# Altium project FMC_ADC_250M_16B_4ch_LNLS.PrjPCB (part 1 of 4)
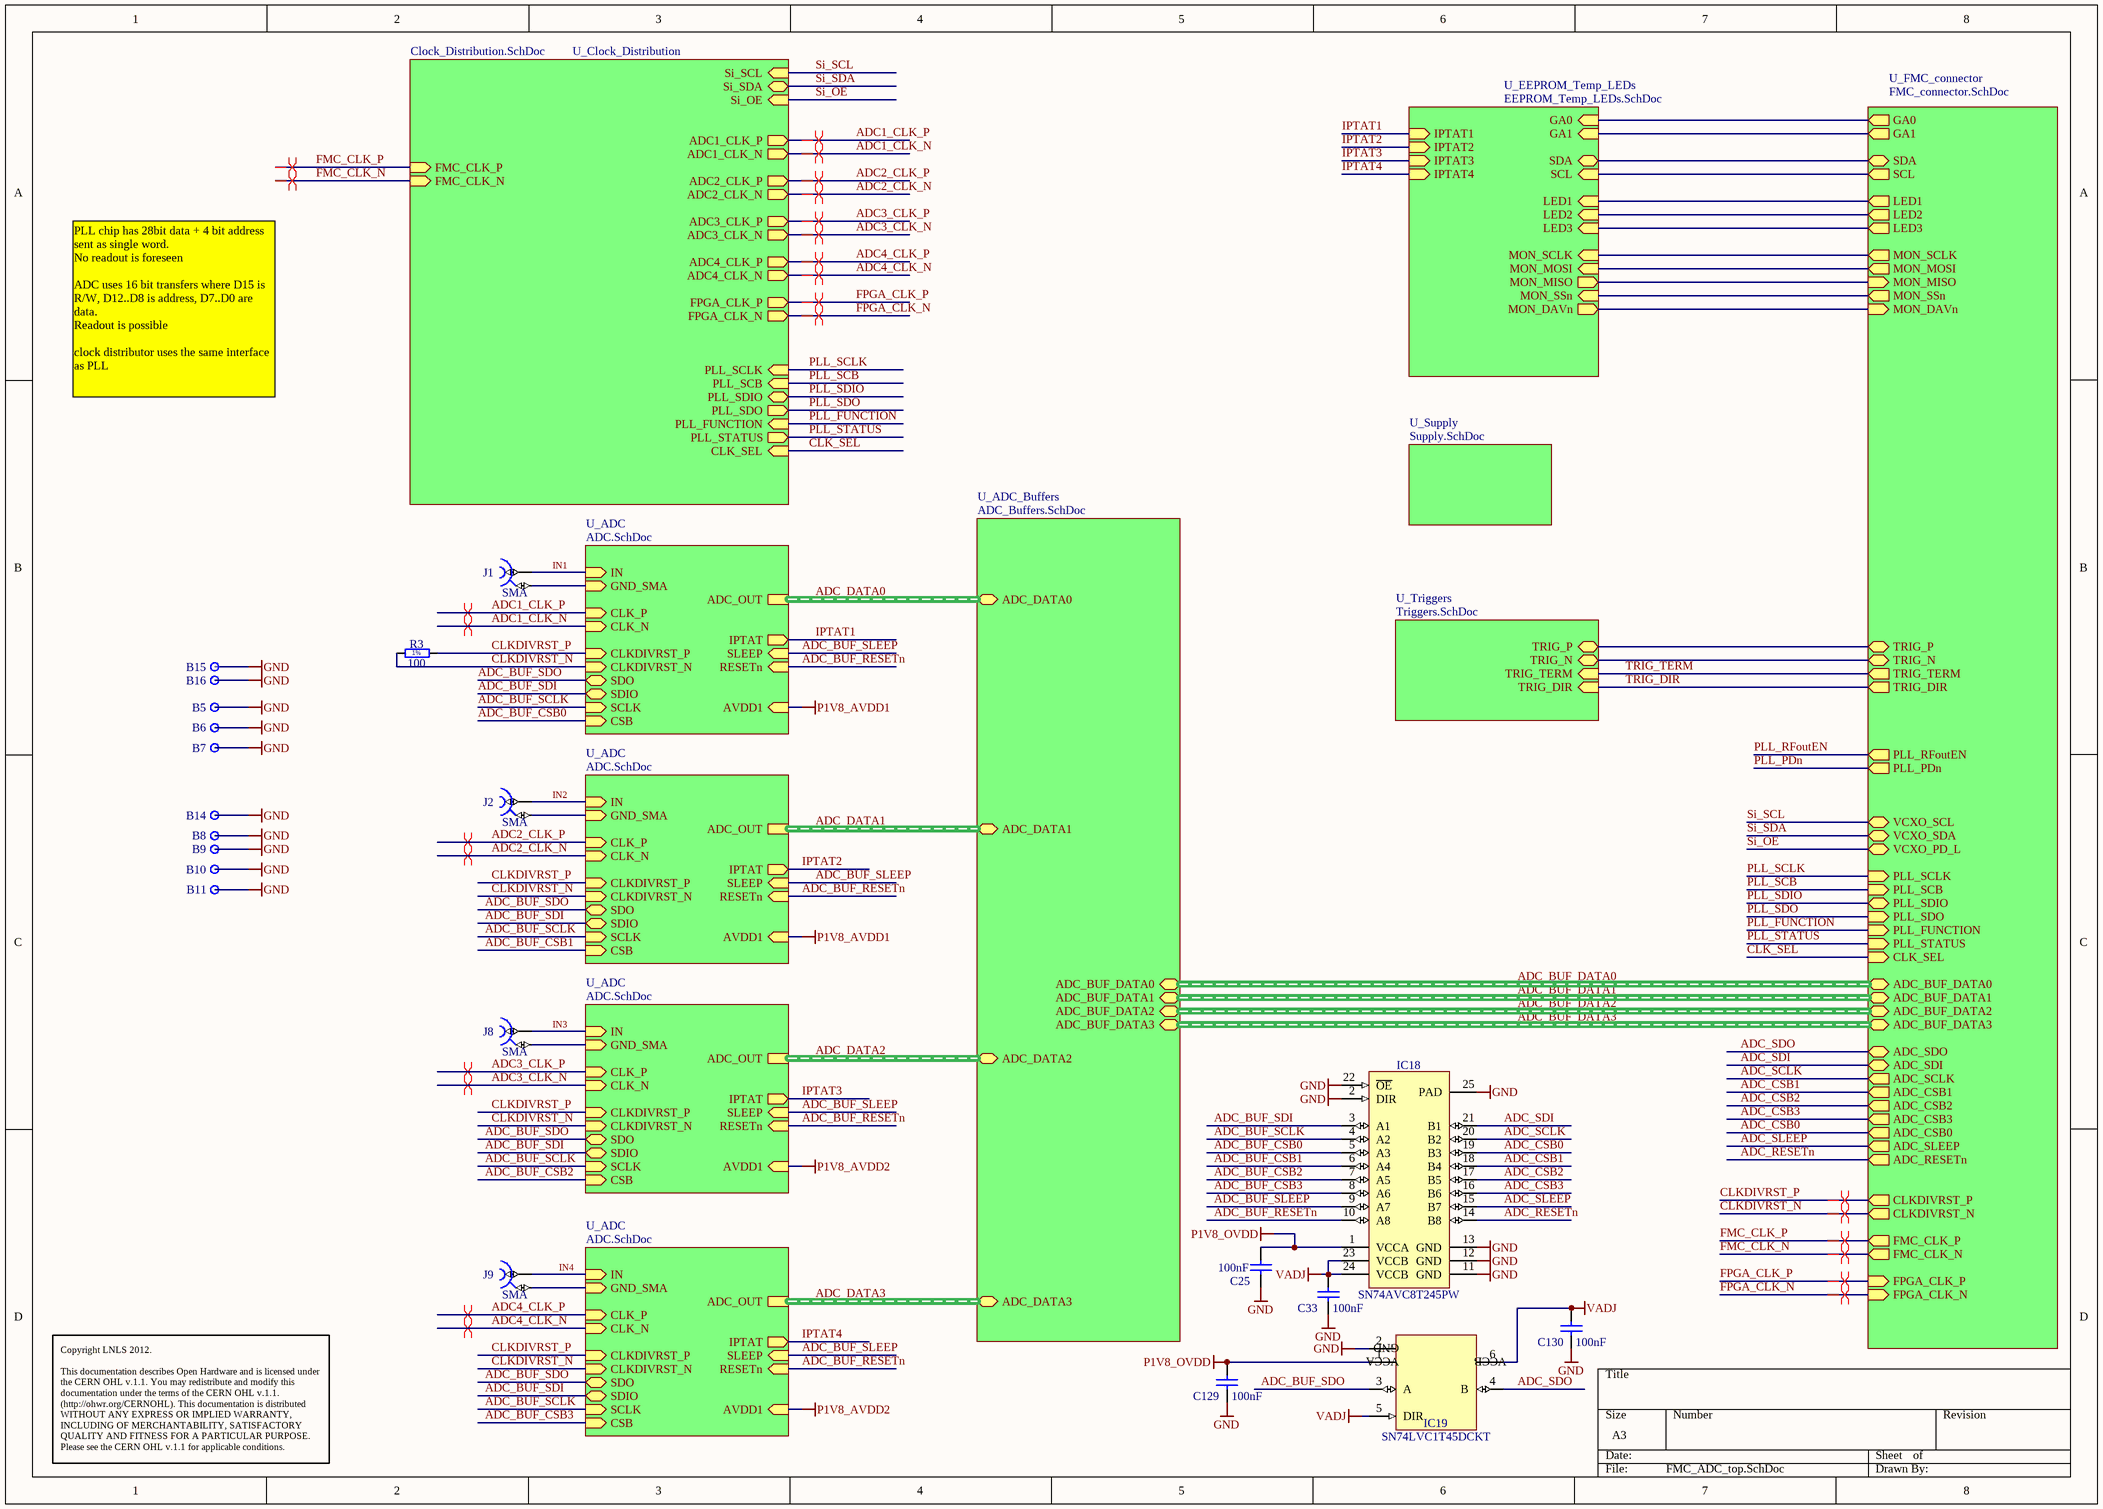
[diagram p0: FMC_ADC_top.SchDoc]
8 sheets, 374 parts. Net scope: hierarchical (ports join the sheet entries above them; power ports are global).
Board files: shield.PcbDoc, FMC_ADC_250M_16B_4ch_pcb.PcbDoc, panel_silk.PcbDoc
Sheets:
  FMC_ADC_top.SchDoc
    U_EEPROM_Temp_LEDs = EEPROM_Temp_LEDs.SchDoc
    U_FMC_connector = FMC_connector.SchDoc
    U_ADC = ADC.SchDoc
    U_Supply = Supply.SchDoc
    U_Clock_Distribution = Clock_Distribution.SchDoc
    U_ADC = ADC.SchDoc
    U_ADC = ADC.SchDoc
    U_ADC = ADC.SchDoc
    U_ADC_Buffers = ADC_Buffers.SchDoc
    U_Triggers = Triggers.SchDoc

## Sheet FMC_ADC_top.SchDoc
size A3

### Parts
B5  Plated Hole  [MTG240_400_M]  (value not drawn)
B6  Plated Hole  [MTG240_400_M]  (value not drawn)
B7  Plated Hole  [MTG240_400_M]  (value not drawn)
B8  Plated Hole  [MTG240_400_M]  (value not drawn)
B9  Plated Hole  [MTG240_400_M]  (value not drawn)
B10  Plated Hole  [MTG240_400_M]  (value not drawn)
B11  Plated Hole  [MTG240_400_M]  (value not drawn)
B14  Plated Hole  [MTG240_400_M]  (value not drawn)
B15  Plated Hole  [MTG240_400_M]  (value not drawn)
B16  Plated Hole  [MTG240_400_M]  (value not drawn)
C25  100nF  [CAPC0603X33N]
C33  100nF  [CAPC0603X33N]
C129  100nF  [CAPC0603X33N]
C130  100nF  [CAPC0603X33N]
IC18  SN74AVC8T245PW  [SOP65P640X120-24N]
IC19  SN74LVC1T45DCKT  [SOT65P210X110-6N]
J1  SMA  [AMPHENOL_901-143_IN BOARD]
J2  SMA  [AMPHENOL_901-143_IN BOARD]
J8  SMA  [AMPHENOL_901-143_IN BOARD]
J9  SMA  [AMPHENOL_901-143_IN BOARD]
R3  100  [RESC1005X40N]

### Sub-sheets
U_ADC = ADC.SchDoc: ADC_OUT (harness ADC_OUT_Harness), SLEEP (in), CLK_P (in), CLK_N (in), IPTAT (out), RESETn (in), CLKDIVRST_P (in), CLKDIVRST_N (in), SDO (bidir), SDIO (bidir), SCLK (in), CSB (in), IN (in), AVDD1 (in), GND_SMA (in)
U_ADC = ADC.SchDoc: ADC_OUT (harness ADC_OUT_Harness), SLEEP (in), CLK_P (in), CLK_N (in), IPTAT (out), RESETn (in), CLKDIVRST_P (in), CLKDIVRST_N (in), SDO (bidir), SDIO (bidir), SCLK (in), CSB (in), IN (in), AVDD1 (in), GND_SMA (in)
U_ADC = ADC.SchDoc: ADC_OUT (harness ADC_OUT_Harness), SLEEP (in), CLK_P (in), CLK_N (in), IPTAT (out), RESETn (in), CLKDIVRST_P (in), CLKDIVRST_N (in), SDO (bidir), SDIO (bidir), SCLK (in), CSB (in), IN (in), AVDD1 (in), GND_SMA (in)
U_ADC = ADC.SchDoc: ADC_OUT (harness ADC_OUT_Harness), SLEEP (in), CLK_P (in), CLK_N (in), IPTAT (out), RESETn (in), CLKDIVRST_P (in), CLKDIVRST_N (in), SDO (bidir), SDIO (bidir), SCLK (in), CSB (in), IN (in), AVDD1 (in), GND_SMA (in)
U_ADC_Buffers = ADC_Buffers.SchDoc: ADC_DATA1 (harness ADC_OUT_Harness), ADC_DATA2 (harness ADC_OUT_Harness), ADC_DATA3 (harness ADC_OUT_Harness), ADC_BUF_DATA1 (harness ADC_OUT_Harness), ADC_BUF_DATA2 (harness ADC_OUT_Harness), ADC_BUF_DATA3 (harness ADC_OUT_Harness), ADC_BUF_DATA0 (harness ADC_OUT_Harness), ADC_DATA0 (harness ADC_OUT_Harness)
U_Clock_Distribution = Clock_Distribution.SchDoc: ADC1_CLK_P (out), ADC1_CLK_N (out), ADC2_CLK_P (out), ADC2_CLK_N (out), ADC3_CLK_P (out), ADC3_CLK_N (out), ADC4_CLK_P (out), ADC4_CLK_N (out), FPGA_CLK_P (out), FPGA_CLK_N (out), FMC_CLK_P (in), FMC_CLK_N (in), Si_SDA (bidir), Si_SCL (in), Si_OE (in), PLL_SCLK (in), PLL_SCB (in), PLL_SDIO (bidir), PLL_SDO (out), PLL_FUNCTION (in), PLL_STATUS (out), CLK_SEL (in)
U_EEPROM_Temp_LEDs = EEPROM_Temp_LEDs.SchDoc: LED1 (in), LED3 (in), SDA (bidir), SCL (in), GA0 (in), GA1 (in), IPTAT1 (in), IPTAT2 (in), IPTAT3 (in), IPTAT4 (in), MON_SCLK (in), MON_MOSI (in), MON_MISO (out), MON_SSn (in), MON_DAVn (out), LED2 (in)
U_FMC_connector = FMC_connector.SchDoc: ADC_BUF_DATA1 (harness ADC_OUT_Harness), ADC_BUF_DATA2 (harness ADC_OUT_Harness), ADC_BUF_DATA3 (harness ADC_OUT_Harness), ADC_BUF_DATA0 (harness ADC_OUT_Harness), ADC_SDO (bidir), ADC_SDI (bidir), ADC_SCLK (out), ADC_CSB1 (out), ADC_CSB2 (out), ADC_CSB3 (out), ADC_CSB0 (out), ADC_RESETn (out), CLKDIVRST_P (out), CLKDIVRST_N (out), FMC_CLK_P (out), FMC_CLK_N (out), FPGA_CLK_P (in), FPGA_CLK_N (in), GA0 (out), GA1 (out), SDA (bidir), SCL (out), VCXO_SCL (bidir), VCXO_SDA (bidir), VCXO_PD_L (bidir), PLL_RFoutEN (out), PLL_PDn (out), TRIG_DIR (out), TRIG_TERM (out), PLL_SCLK (in), PLL_SCB (in), PLL_SDIO (bidir), PLL_SDO (in), PLL_FUNCTION (in), PLL_STATUS (in), CLK_SEL (in), TRIG_P (bidir), TRIG_N (bidir), MON_SCLK (out), MON_MOSI (out), MON_MISO (in), MON_SSn (out), MON_DAVn (in), ADC_SLEEP (out), LED1 (out), LED2 (out), LED3 (out)
U_Supply = Supply.SchDoc: no entries
U_Triggers = Triggers.SchDoc: TRIG_DIR (in), TRIG_N (bidir), TRIG_P (bidir), TRIG_TERM (in)

### Nets
GND: B5.1 B6.1 B7.1 B8.1 B9.1 B10.1 B11.1 B14.1 B15.1 B16.1 C25.2 C33.1 C129.1 C130.1 IC18.2(DIR) IC18.11(GND) IC18.12(GND) IC18.13(GND) IC18.22(~{OE}) IC18.25(PAD) IC19.2(GND)
P1V8_AVDD1: sheet U_ADC/AVDD1, sheet U_ADC/AVDD1
P1V8_AVDD2: sheet U_ADC/AVDD1, sheet U_ADC/AVDD1
P1V8_OVDD: C25.1 C129.2 IC18.1(VCCA) IC19.1(VCCA)
VADJ: C33.2 C130.2 IC18.23(VCCB) IC18.24(VCCB) IC19.5(DIR) IC19.6(VCCB)
ADC1_CLK_N: sheet U_ADC/CLK_N, sheet U_Clock_Distribution/ADC1_CLK_N
ADC1_CLK_P: sheet U_ADC/CLK_P, sheet U_Clock_Distribution/ADC1_CLK_P
ADC2_CLK_N: sheet U_Clock_Distribution/ADC2_CLK_N, sheet U_ADC/CLK_N
ADC2_CLK_P: sheet U_Clock_Distribution/ADC2_CLK_P, sheet U_ADC/CLK_P
ADC3_CLK_N: sheet U_Clock_Distribution/ADC3_CLK_N, sheet U_ADC/CLK_N
ADC3_CLK_P: sheet U_Clock_Distribution/ADC3_CLK_P, sheet U_ADC/CLK_P
ADC4_CLK_N: sheet U_Clock_Distribution/ADC4_CLK_N, sheet U_ADC/CLK_N
ADC4_CLK_P: sheet U_Clock_Distribution/ADC4_CLK_P, sheet U_ADC/CLK_P
ADC_BUF_CSB0: IC18.5(A3) ; sheet U_ADC/CSB
ADC_BUF_CSB1: IC18.6(A4) ; sheet U_ADC/CSB
ADC_BUF_CSB2: IC18.7(A5) ; sheet U_ADC/CSB
ADC_BUF_CSB3: IC18.8(A6) ; sheet U_ADC/CSB
ADC_BUF_RESETn: IC18.10(A8) ; sheet U_ADC/RESETn, sheet U_ADC/RESETn, sheet U_ADC/RESETn, sheet U_ADC/RESETn
ADC_BUF_SCLK: IC18.4(A2) ; sheet U_ADC/SCLK, sheet U_ADC/SCLK, sheet U_ADC/SCLK, sheet U_ADC/SCLK
ADC_BUF_SDI: IC18.3(A1) ; sheet U_ADC/SDIO, sheet U_ADC/SDIO, sheet U_ADC/SDIO, sheet U_ADC/SDIO
ADC_BUF_SDO: IC19.3(A) ; sheet U_ADC/SDO, sheet U_ADC/SDO, sheet U_ADC/SDO, sheet U_ADC/SDO
ADC_BUF_SLEEP: IC18.9(A7) ; sheet U_ADC/SLEEP, sheet U_ADC/SLEEP, sheet U_ADC/SLEEP, sheet U_ADC/SLEEP
ADC_CSB0: IC18.19(B3) ; sheet U_FMC_connector/ADC_CSB0
ADC_CSB1: IC18.18(B4) ; sheet U_FMC_connector/ADC_CSB1
ADC_CSB2: IC18.17(B5) ; sheet U_FMC_connector/ADC_CSB2
ADC_CSB3: IC18.16(B6) ; sheet U_FMC_connector/ADC_CSB3
ADC_RESETn: IC18.14(B8) ; sheet U_FMC_connector/ADC_RESETn
ADC_SCLK: IC18.20(B2) ; sheet U_FMC_connector/ADC_SCLK
ADC_SDI: IC18.21(B1) ; sheet U_FMC_connector/ADC_SDI
ADC_SDO: IC19.4(B) ; sheet U_FMC_connector/ADC_SDO
ADC_SLEEP: IC18.15(B7) ; sheet U_FMC_connector/ADC_SLEEP
CLK_SEL: sheet U_FMC_connector/CLK_SEL, sheet U_Clock_Distribution/CLK_SEL
CLKDIVRST_N: R3.1 ; sheet U_FMC_connector/CLKDIVRST_N, sheet U_ADC/CLKDIVRST_N, sheet U_ADC/CLKDIVRST_N, sheet U_ADC/CLKDIVRST_N, sheet U_ADC/CLKDIVRST_N
CLKDIVRST_P: R3.2 ; sheet U_FMC_connector/CLKDIVRST_P, sheet U_ADC/CLKDIVRST_P, sheet U_ADC/CLKDIVRST_P, sheet U_ADC/CLKDIVRST_P, sheet U_ADC/CLKDIVRST_P
FMC_CLK_N: sheet U_FMC_connector/FMC_CLK_N, sheet U_Clock_Distribution/FMC_CLK_N
FMC_CLK_P: sheet U_FMC_connector/FMC_CLK_P, sheet U_Clock_Distribution/FMC_CLK_P
FPGA_CLK_N: sheet U_FMC_connector/FPGA_CLK_N, sheet U_Clock_Distribution/FPGA_CLK_N
FPGA_CLK_P: sheet U_FMC_connector/FPGA_CLK_P, sheet U_Clock_Distribution/FPGA_CLK_P
GA0: sheet U_EEPROM_Temp_LEDs/GA0, sheet U_FMC_connector/GA0
GA1: sheet U_EEPROM_Temp_LEDs/GA1, sheet U_FMC_connector/GA1
IN1: J1.1 ; sheet U_ADC/IN
IN2: J2.1 ; sheet U_ADC/IN
IN3: J8.1 ; sheet U_ADC/IN
IN4: J9.1 ; sheet U_ADC/IN
IPTAT1: sheet U_EEPROM_Temp_LEDs/IPTAT1, sheet U_ADC/IPTAT
IPTAT2: sheet U_EEPROM_Temp_LEDs/IPTAT2, sheet U_ADC/IPTAT
IPTAT3: sheet U_EEPROM_Temp_LEDs/IPTAT3, sheet U_ADC/IPTAT
IPTAT4: sheet U_EEPROM_Temp_LEDs/IPTAT4, sheet U_ADC/IPTAT
LA24_N: sheet U_EEPROM_Temp_LEDs/LED2, sheet U_FMC_connector/LED2
LA24_P: sheet U_EEPROM_Temp_LEDs/LED3, sheet U_FMC_connector/LED3
LA28_N: sheet U_EEPROM_Temp_LEDs/MON_DAVn, sheet U_FMC_connector/MON_DAVn
LA29_P: sheet U_EEPROM_Temp_LEDs/LED1, sheet U_FMC_connector/LED1
LA30_N: sheet U_EEPROM_Temp_LEDs/MON_SSn, sheet U_FMC_connector/MON_SSn
LA30_P: sheet U_EEPROM_Temp_LEDs/MON_MISO, sheet U_FMC_connector/MON_MISO
LA31_N: sheet U_EEPROM_Temp_LEDs/MON_MOSI, sheet U_FMC_connector/MON_MOSI
LA31_P: sheet U_EEPROM_Temp_LEDs/MON_SCLK, sheet U_FMC_connector/MON_SCLK
LA33_N: sheet U_FMC_connector/TRIG_N, sheet U_Triggers/TRIG_N
LA33_P: sheet U_FMC_connector/TRIG_P, sheet U_Triggers/TRIG_P
PLL_FUNCTION: sheet U_FMC_connector/PLL_FUNCTION, sheet U_Clock_Distribution/PLL_FUNCTION
PLL_SCB: sheet U_FMC_connector/PLL_SCB, sheet U_Clock_Distribution/PLL_SCB
PLL_SCLK: sheet U_FMC_connector/PLL_SCLK, sheet U_Clock_Distribution/PLL_SCLK
PLL_SDIO: sheet U_FMC_connector/PLL_SDIO, sheet U_Clock_Distribution/PLL_SDIO
PLL_SDO: sheet U_FMC_connector/PLL_SDO, sheet U_Clock_Distribution/PLL_SDO
PLL_STATUS: sheet U_FMC_connector/PLL_STATUS, sheet U_Clock_Distribution/PLL_STATUS
SCL: sheet U_EEPROM_Temp_LEDs/SCL, sheet U_FMC_connector/SCL
SDA: sheet U_EEPROM_Temp_LEDs/SDA, sheet U_FMC_connector/SDA
Si_OE: sheet U_FMC_connector/VCXO_PD_L, sheet U_Clock_Distribution/Si_OE
Si_SCL: sheet U_FMC_connector/VCXO_SCL, sheet U_Clock_Distribution/Si_SCL
Si_SDA: sheet U_FMC_connector/VCXO_SDA, sheet U_Clock_Distribution/Si_SDA
TRIG_DIR: sheet U_FMC_connector/TRIG_DIR, sheet U_Triggers/TRIG_DIR
TRIG_TERM: sheet U_FMC_connector/TRIG_TERM, sheet U_Triggers/TRIG_TERM
NetC55A_1: J1.2 ; sheet U_ADC/GND_SMA
NetC55B_1: J2.2 ; sheet U_ADC/GND_SMA
NetC55C_1: J8.2 ; sheet U_ADC/GND_SMA
NetC55D_1: J9.2 ; sheet U_ADC/GND_SMA

### Buses and harness runs
harness ADC_BUF_DATA0 = sheet U_ADC_Buffers/ADC_BUF_DATA0 = sheet U_FMC_connector/ADC_BUF_DATA0
harness ADC_BUF_DATA1 = sheet U_ADC_Buffers/ADC_BUF_DATA1 = sheet U_FMC_connector/ADC_BUF_DATA1
harness ADC_BUF_DATA2 = sheet U_ADC_Buffers/ADC_BUF_DATA2 = sheet U_FMC_connector/ADC_BUF_DATA2
harness ADC_BUF_DATA3 = sheet U_ADC_Buffers/ADC_BUF_DATA3 = sheet U_FMC_connector/ADC_BUF_DATA3
harness ADC_DATA0 = sheet U_ADC/ADC_OUT = sheet U_ADC_Buffers/ADC_DATA0
harness ADC_DATA1 = sheet U_ADC/ADC_OUT = sheet U_ADC_Buffers/ADC_DATA1
harness ADC_DATA2 = sheet U_ADC/ADC_OUT = sheet U_ADC_Buffers/ADC_DATA2
harness ADC_DATA3 = sheet U_ADC/ADC_OUT = sheet U_ADC_Buffers/ADC_DATA3

### Layout directives
differential pair: ADC1_CLK_N, ADC1_CLK_P, ADC2_CLK_N, ADC2_CLK_P, ADC3_CLK_N, ADC3_CLK_P, ADC4_CLK_N, ADC4_CLK_P, CLKDIVRST_N, CLKDIVRST_P, FMC_CLK_N, FMC_CLK_P, FPGA_CLK_N, FPGA_CLK_P

### Notes on the sheet
- PLL chip has 28bit data + 4 bit address sent as single word.
  No readout is foreseen
  ADC uses 16 bit transfers where D15 is R/W, D12..D8 is address, D7..D0 are data.
  Readout is possible
  clock distributor uses the same interface as PLL
- Copyright LNLS 2012.
  This documentation describes Open Hardware and is licensed under the CERN OHL v.1.1. You may redistribute and modify this documentation under the terms of the CERN OHL v.1.1. (http://ohwr.org/CERNOHL). This documentation is distributed WITHOUT ANY EXPRESS OR IMPLIED WARRANTY, INCLUDING OF MERCHANTABILITY, SATISFACTORY QUALITY AND FITNESS FOR A PARTICULAR PURPOSE. Please see the CERN OHL v.1.1 for applicable conditions.
- (in symbol R0402_100R_1%_0.0625W_100PPM) 1%

### Library data of the parts
B5-B11 B14-B16 = PLATED_HOLE2.4_PAD4.0_M: Single Terminal Socket; Part Description: Plated Through Hole: Hole Dia.=2.4mm Pad Dia.=4.0mm Middle hole 2.8mm; Mounted: No; Part Number: PLATED_HOLE2.4_PAD4.0_M; Component Kind: Standard (No BOM); Component Type: Standard (No BOM); Pin Count: 1; Family: Plated Hole; Socket: No; SMD: No; Status: None; ComponentHeight: 0mm; Author: LNLS DIG FCS; CreateDate: 06/06/2016; LatestRevisionDate: 06/06/2016; PackageDescription: Plated Through Hole: Hole Dia.=2.4mm Pad Dia.=4.0mm Middle hole 2.8mm; Sense: No; HelpURL: Undefined
C25 C33 C129 C130 = CC0201_100NF_6.3V_10%_X5R: Non-polarised capacitor; Part Description: SMD Multilayer Chip Ceramic Capacitor; Manufacturer: GENERIC; Manufacturer1 Part Number: 02016D104KAT2A; Voltage: 6.3V; TC: X5R; Tolerance: ±10%; Table: Capacitors SMD; Part Number: CC0201_100NF_6.3V_10%_X5R; Component Kind: Standard; Component Type: Standard; Pin Count: 2; Value: 100nF; Status: Not Recommended; Manufacturer Part Number: CC0201_100NF_6.3V_10%_X5R; Case: 0201; Mounted: Yes; Socket: No; SMD: Yes; Manufacturer1 Example: AVX; Manufacturer1 ComponentHeight: 0.33mm; HelpURL: \\cern.ch\dfs\Applications\Altium\Datasheets\CC0201_X5R_AVX.pdf; Author: CERN DEM JLC; CreateDate: 03/12/2007; LatestRevisionDate: 03/12/2007; Sense: No
IC18 = SN74AVC8T245PW: 8-Bit Dual-Supply Bus Transceiver With Configurable Voltage Translation and 3-State Outputs; Manufacturer: TEXAS INSTRUMENTS; PressFit: No; Bonding: No; Part Number: SN74AVC8T245PW; Component Kind: Standard; Component Type: Standard; Device: SN74AVC8T245PW; PackageDescription: SOP, 0.65mm Pitch; 24 Pin, 4.40mm W X 7.80mm L X 1.20mm H Body, IPC Medium Density; Part Description: 8-Bit Dual-Supply Bus Transceiver With Configurable Voltage Translation and 3-State Outputs; Manufacturer Part Number: SN74AVC8T245PW; Pin Count: 24; Case: TSSOP24; Mounted: Yes; Socket: No; SMD: Yes; Sense: No; ComponentHeight: 1.2mm; Author: CERN DEM JLC; HelpURL: \\cern.ch\dfs\Applications\Altium\Datasheets\SN74AVC8T245PW.pdf; CreateDate: 07/03/2012; LatestRevisionDate: 07/03/2012
IC19 = SN74LVC1T45DCKT: Single-Bit Dual-Supply Bus Transceiver; Part Description: Single-Bit Dual-Supply Bus Transceiver with Configurable Voltage Translation and 3-State Outputs; Manufacturer: TEXAS INSTRUMENTS; PressFit: No; Bonding: No; Part Number: SN74LVC1T45DCKT; Component Kind: Standard; Component Type: Standard; Device: SN74LVC1T45DCKT; PackageDescription: SOT363, SC70-6, SOT, 0.65mm Pitch, 6 pin, 1.25mm W X 2.00mm L X 1.10mm H, IPC Medium Density; Manufacturer Part Number: SN74LVC1T45DCKT; Pin Count: 6; Case: SOT363; Mounted: Yes; Socket: No; SMD: Yes; Sense: No; ComponentHeight: 1.1mm; Author: CERN DEM JLC; HelpURL: \\cern.ch\dfs\Applications\Altium\Datasheets\SN74LVC1T45DCKT.pdf; CreateDate: 27/09/2010; LatestRevisionDate: 27/09/2010
J1 J2 J8 J9 = AMPHENOL_901-143-6RFX: Part Description: 50 Ohm Through Hole SMA 90 degrees PCB Jack; PressFit: No; Part Number: AMPHENOL_901-143-6RFX; Component Kind: Standard; Component Type: Standard; Pin Count: 5; Family: SMA; Mounted: Yes; Socket: No; SMD: No; Sense: No; Status: None; Manufacturer: AMPHENOL; Manufacturer Part Number: 901-143-6RFX; ComponentHeight: 10.0mm; Author: LNLS DIG GBMB; CreateDate: 31/05/2016; LatestRevisionDate: 31/05/2016
R3 = R0402_100R_1%_0.0625W_100PPM: Resistor - 1%; Part Description: General Purpose Thick Film Chip Resistor; Manufacturer: GENERIC; Manufacturer1 Part Number: 232270671001L; TC: ±100ppm/°C; Table: Resistors SMD; Part Number: R0402_100R_1%_0.0625W_100PPM; Component Kind: Standard; Component Type: Standard; Pin Count: 2; Value: 100; Status: Not recommended; Power: 0.0625W; Tolerance: ±1%; Manufacturer Part Number: R0402_100R_1%_0.0625W_100PPM; Case: 0402; Mounted: Yes; Socket: No; SMD: Yes; Manufacturer1 Example: YAGEO PHYCOMP; Manufacturer1 ComponentHeight: 0.4mm; HelpURL: \\cern.ch\dfs\Applications\Altium\Datasheets\R0402_Phycomp_RC0402.pdf; Author: CERN DEM JLC; CreateDate: 03/12/2007; LatestRevisionDate: 17/10/2012; Sense: No

## Sheet EEPROM_Temp_LEDs.SchDoc
size A3
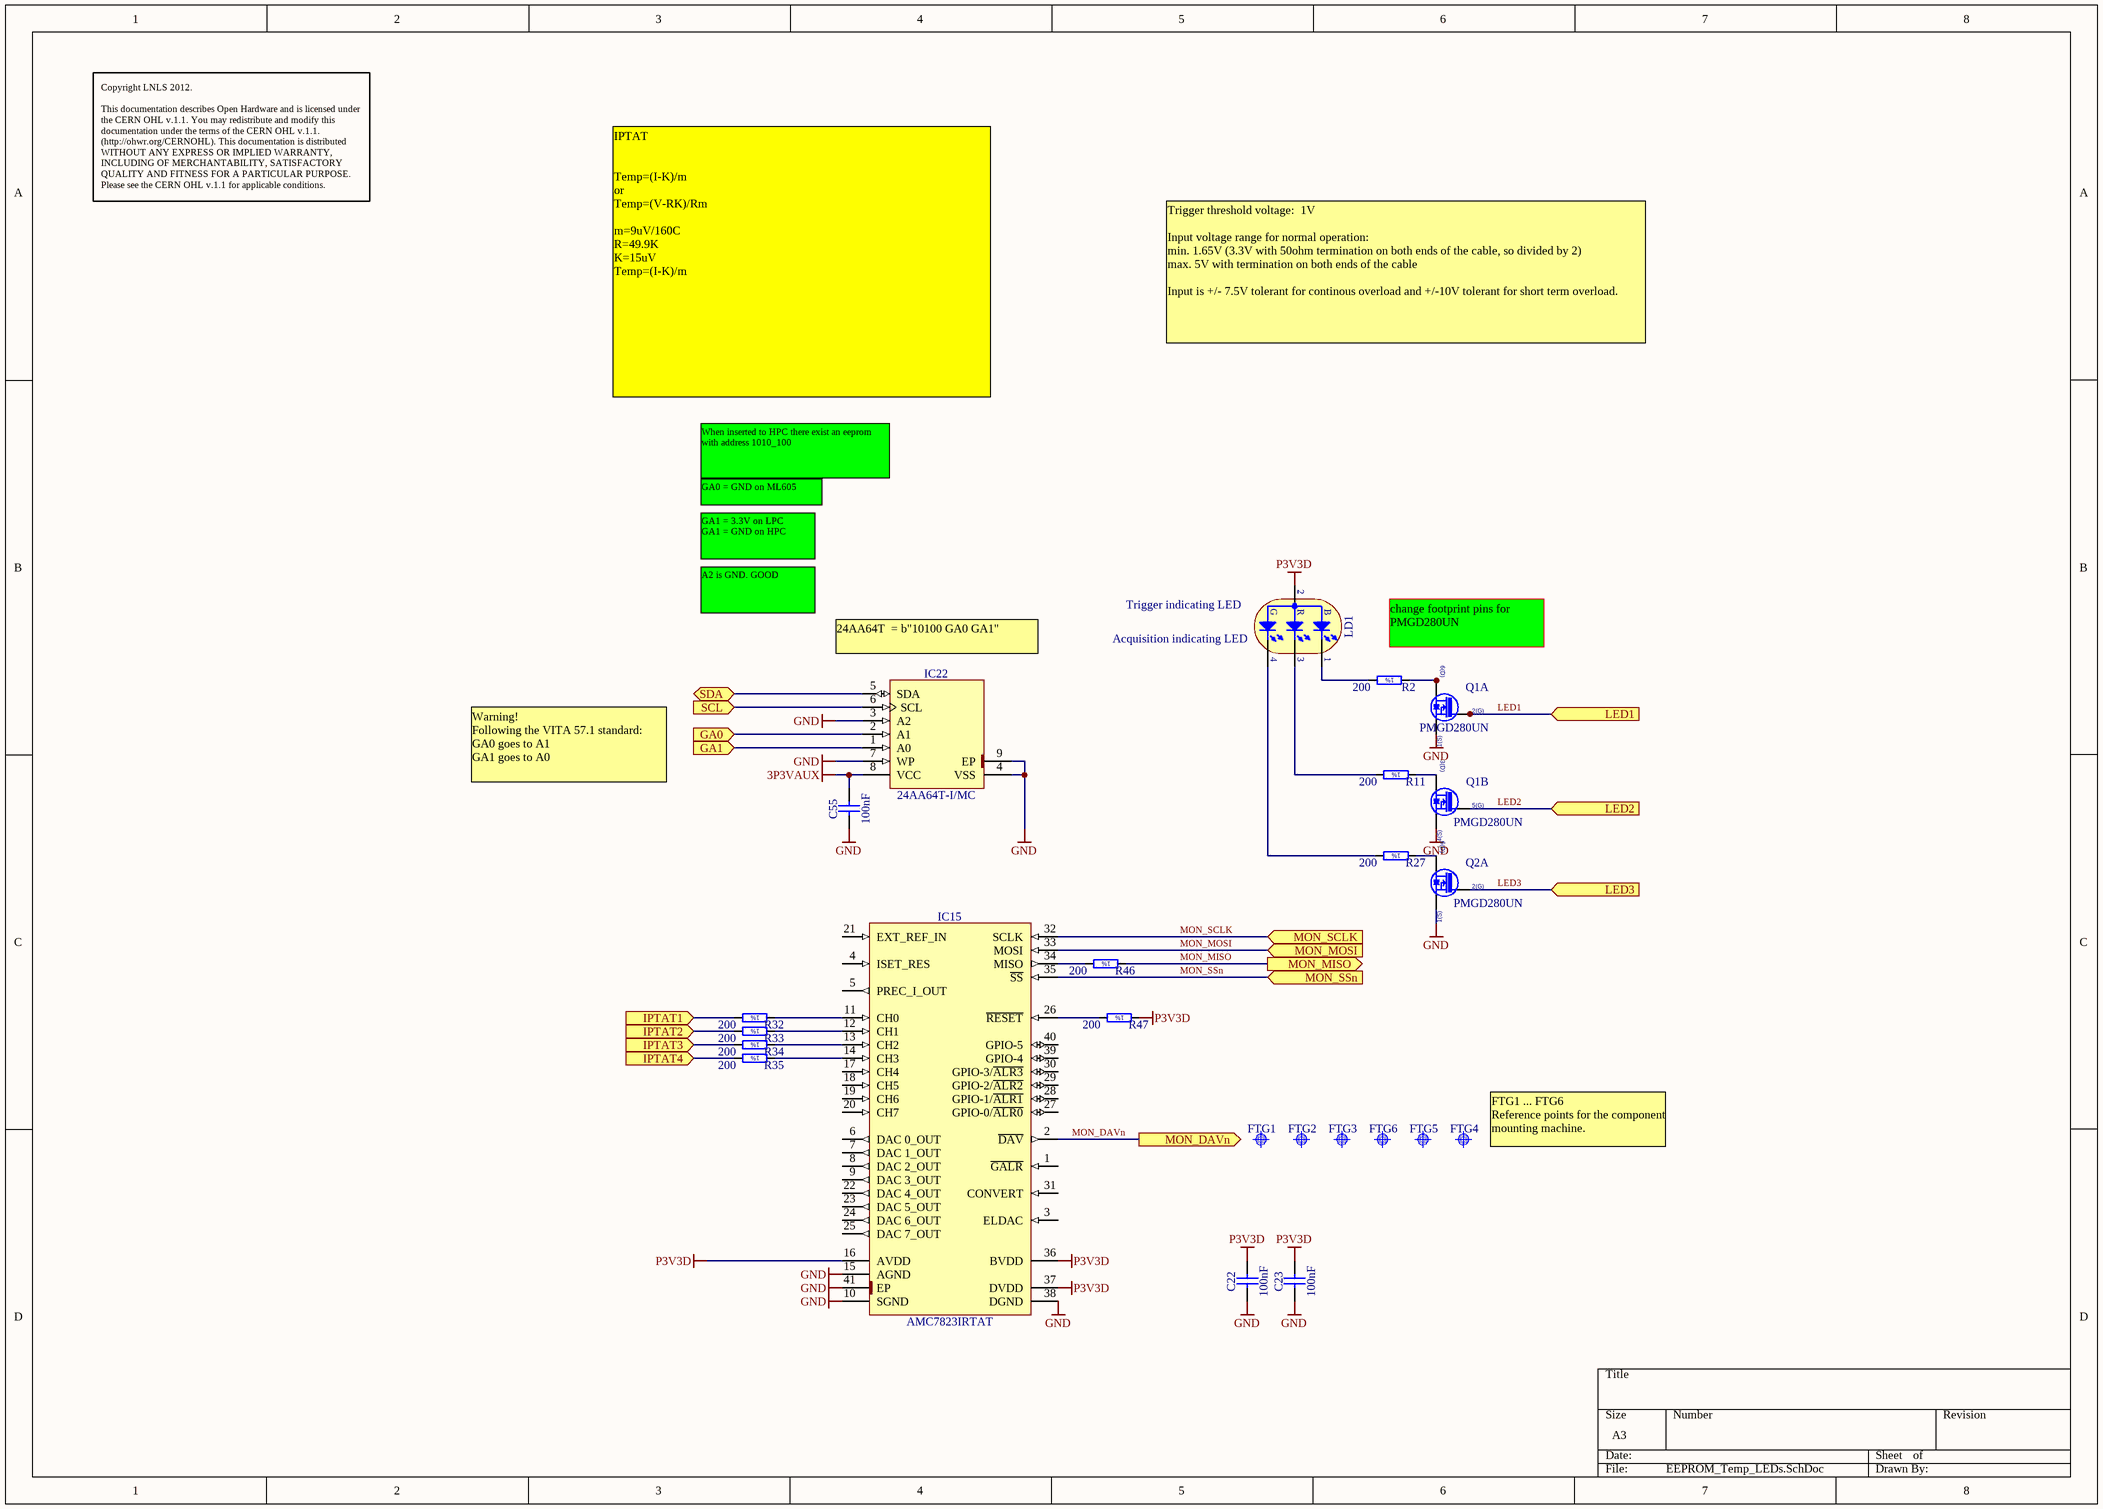
[diagram p1: EEPROM_Temp_LEDs.SchDoc]

### Parts
C22  100nF  [CAPC0603X33N]
C23  100nF  [CAPC0603X33N]
C55  100nF  [CAPC0603X33N]
FTG1  Use only in PCB  [FIDUCIAL_TOP_S100-200]  (value not drawn)
FTG2  Use only in PCB  [FIDUCIAL_TOP_S100-200]  (value not drawn)
FTG3  Use only in PCB  [FIDUCIAL_TOP_S100-200]  (value not drawn)
FTG4  Use only in PCB  [FIDUCIAL_TOP_S100-200]  (value not drawn)
FTG5  Use only in PCB  [FIDUCIAL_TOP_S100-200]  (value not drawn)
FTG6  Use only in PCB  [FIDUCIAL_TOP_S100-200]  (value not drawn)
IC15  AMC7823IRTAT  [QFN50P600X600X80-41N-S425]
IC22  24AA64T-I/MC  [SON50P300X200X100-9N-R175X155]
LD1  (no value)  [LED_AVAGO_HSMF-C113]
Q1  PMGD280UN  [SOT65P210X110-6N]  (parts A,B of 2)
Q2  PMGD280UN  [SOT65P210X110-6N]  (part A of 2)
R2  200  [RESC1005X40N]
R11  200  [RESC1005X40N]
R27  200  [RESC1005X40N]
R32  200  [RESC1005X40N]
R33  200  [RESC1005X40N]
R34  200  [RESC1005X40N]
R35  200  [RESC1005X40N]
R46  200  [RESC1005X40N]
R47  200  [RESC1005X40N]

### Ports
GA0 (in), GA1 (in), IPTAT1 (in), IPTAT2 (in), IPTAT3 (in), IPTAT4 (in), LED1 (in), LED2 (in), LED3 (in), MON_DAVn (out), MON_MISO (out), MON_MOSI (in), MON_SCLK (in), MON_SSn (in), SCL (in), SDA (bidir)

### Nets
3P3VAUX: C55.2 IC22.8(VCC)
GND: C22.1 C23.1 C55.1 IC15.10(SGND) IC15.15(AGND) IC15.38(DGND) IC15.41(EP) IC22.3(A2) IC22.4(VSS) IC22.7(WP) IC22.9(EP) Q1.1(S) Q1.4(S) Q2.1(S)
P3V3D: C22.2 C23.2 IC15.16(AVDD) IC15.36(BVDD) IC15.37(DVDD) LD1.2(AC) R47.1
GA0: IC22.2(A1) ; port GA0
GA1: IC22.1(A0) ; port GA1
IPTAT1: R32.2 ; port IPTAT1
IPTAT2: R33.2 ; port IPTAT2
IPTAT3: R34.2 ; port IPTAT3
IPTAT4: R35.2 ; port IPTAT4
LED1: Q1.2(G) ; port LED1  [project net LA29_P]
LED2: Q1.5(G) ; port LED2  [project net LA24_N]
LED3: Q2.2(G) ; port LED3  [project net LA24_P]
MON_DAVn: IC15.2(~{DAV}) ; port MON_DAVn  [project net LA28_N]
MON_MISO: R46.1 ; port MON_MISO  [project net LA30_P]
MON_MOSI: IC15.33(MOSI) ; port MON_MOSI  [project net LA31_N]
MON_SCLK: IC15.32(SCLK) ; port MON_SCLK  [project net LA31_P]
MON_SSn: IC15.35(~{SS}) ; port MON_SSn  [project net LA30_N]
SCL: IC22.6(SCL) ; port SCL
SDA: IC22.5(SDA) ; port SDA
NetIC15_11: IC15.11(CH0) R32.1
NetIC15_12: IC15.12(CH1) R33.1
NetIC15_13: IC15.13(CH2) R34.1
NetIC15_14: IC15.14(CH3) R35.1
NetIC15_26: IC15.26(~{RESET}) R47.2
NetIC15_34: IC15.34(MISO) R46.2
NetLD1_1: LD1.1(CB) R2.2
NetLD1_3: LD1.3(CR) R11.2
NetLD1_4: LD1.4(CG) R27.2
NetQ1_3: Q1.3(D) R11.1
NetQ1_6: Q1.6(D) R2.1
NetQ2_6: Q2.6(D) R27.1

Not connected (* = marked no-connect by the designer): IC15 1(~{GALR}) 3(ELDAC) 4(ISET_RES) 5(PREC_I_OUT) 6(DAC_0_OUT) 7(DAC_1_OUT) 8(DAC_2_OUT) 9(DAC_3_OUT) 17(CH4) 18(CH5) 19(CH6) 20(CH7) 21(EXT_REF_IN) 22(DAC_4_OUT) 23(DAC_5_OUT) 24(DAC_6_OUT) 25(DAC_7_OUT) 27(GPIO-0/~{ALR0}) 28(GPIO-1/~{ALR1}) 29(GPIO-2/~{ALR2}) 30(GPIO-3/~{ALR3}) 31(CONVERT) 39(GPIO-4) 40(GPIO-5)

### Notes on the sheet
- Copyright LNLS 2012.
  This documentation describes Open Hardware and is licensed under the CERN OHL v.1.1. You may redistribute and modify this documentation under the terms of the CERN OHL v.1.1. (http://ohwr.org/CERNOHL). This documentation is distributed WITHOUT ANY EXPRESS OR IMPLIED WARRANTY, INCLUDING OF MERCHANTABILITY, SATISFACTORY QUALITY AND FITNESS FOR A PARTICULAR PURPOSE. Please see the CERN OHL v.1.1 for applicable conditions.
- Trigger threshold voltage:  1V
  Input voltage range for normal operation:
  min. 1.65V (3.3V with 50ohm termination on both ends of the cable, so divided by 2)
  max. 5V with termination on both ends of the cable
  Input is +/- 7.5V tolerant for continous overload and +/-10V tolerant for short term overload.
- IPTAT
  Temp=(I-K)/m
  or
  Temp=(V-RK)/Rm
  m=9uV/160C
  R=49.9K
  K=15uV
  Temp=(I-K)/m
- GA0 = GND on ML605
- When inserted to HPC there exist an eeprom with address 1010_100
- GA1 = 3.3V on LPC
  GA1 = GND on HPC
- A2 is GND. GOOD
- (near IC22) 24AA64T  = b"10100 GA0 GA1"
- (near LD1) Acquisition indicating LED
- (near LD1) Trigger indicating LED
- change footprint pins for PMGD280UN
- Warning!
  Following the VITA 57.1 standard:
  GA0 goes to A1
  GA1 goes to A0
- (near FTG4) FTG1 ... FTG6
  Reference points for the component mounting machine.
- (in symbol LED_AVAGO_HSMF-C113) G; R; B
- (in symbol PMGD280UN, part A) 6(D); 2(G); 1(S)
- (in symbol PMGD280UN, part B) 3(D); 5(G); 4(S)
- (in symbol R0402_200R_1%_0.0625W_100PPM) 1%

### Library data of the parts
C22 C23 C55 = CC0201_100NF_6.3V_10%_X5R: as C25 on sheet FMC_ADC_top; Part Number: CC0201_100NF_6.3V_10%_X5R; Component Kind: Standard; Component Type: Standard; Pin Count: 2; Value: 100nF; Status: Not Recommended; Manufacturer Part Number: CC0201_100NF_6.3V_10%_X5R; Case: 0201; Mounted: Yes; Socket: No; SMD: Yes; Manufacturer1 Example: AVX; Manufacturer1 ComponentHeight: 0.33mm; HelpURL: \\cern.ch\dfs\Applications\Altium\Datasheets\CC0201_X5R_AVX.pdf; Author: CERN DEM JLC; CreateDate: 03/12/2007; LatestRevisionDate: 03/12/2007; Sense: No
FTG1-FTG6 = FIDUCIAL_TARGET_S100-200: Fiducial Target; Part Description: Scare Fiducial Target, Top Layer, 1.0mm, Top Sloder 2.0mm, Keepout =2.0mm; Mounted: No; Table: Pads; Part Number: FIDUCIAL_TARGET_S100-200; Component Kind: Standard (No BOM); Component Type: Standard (No BOM); Pin Count: 1; Family: Fiducial; Socket: No; SMD: Yes; Status: None; ComponentHeight: 0mm; Author: CERN DEM JLC; CreateDate: 09.02.2010; LatestRevisionDate: 09.02.2010; PackageDescription: Scare Fiducial Target, Top Layer, 1.0mm, Top Sloder 2.0mm, Keepout =2.0mm
IC15 = AMC7823IRTAT: Integrated, Multichannel ADC and DAC for Analog Monitoring & Control; Manufacturer: TEXAS INSTRUMENTS; Table: Analog & Interface; Bonding: No; PressFit: No; Part Number: AMC7823IRTAT; Component Kind: Standard; Component Type: Standard; Device: AMC7823IRTAT; PackageDescription: QFN, 0.50mm Pitch, Square; 40 Pin, 6.00mm L X 6.00mm W X 0.80mm H body (w/Thermal Tab 4.25 x 4.25mm), IPC Medium Density; Part Description: Integrated, Multichannel ADC and DAC for Analog Monitoring & Control; Manufacturer Part Number: AMC7823IRTAT; Pin Count: 41; Case: QFN40; Mounted: Yes; Socket: No; SMD: Yes; ComponentHeight: 0.8mm; Author: CERN DEM JLC; HelpURL: \\cern.ch\dfs\Applications\Altium\Datasheets\AMC7823IRTAT.pdf; CreateDate: 11/10/2012; LatestRevisionDate: 11/10/2012; Sense: No
IC22 = 24AA64T-I/MC: 1.7-5.5V 64K I2C Serial EEPROM; Part Description: 1.7V-5.5V, 64K  (8K x 8-bit) I2C Serial EEPROM; Manufacturer: MICROCHIP TECHNOLOGY; Table: Logic; Bonding: No; PressFit: No; Part Number: 24AA64T-I/MC; Component Kind: Standard; Component Type: Standard; Device: 24AA64T-I/MC; Footprint: SON50P300X200X100-9N-S175X155; PackageDescription: SON (DFN), 0.50mm pitch, 8 pin, 2mm X 3mm X 1.00mm H body (w/thermal tab 1.75 X 1.55mm),  IPC Medium Density; Manufacturer Part Number: 24AA64T-I/MC; Pin Count: 9; Case: DFN8; Mounted: Yes; Socket: No; SMD: Yes; ComponentHeight: 1mm; HelpURL: \\cern.ch\dfs\Applications\Altium\Datasheets\24AA64T-I-MC.pdf; Author: CERN DEM JLC; CreateDate: 18/11/2009; LatestRevisionDate: 24/01/2011; Sense: No
LD1 = LED_AVAGO_HSMF-C113: Tricolor LEDs 1 Cathode Blue, 2 Common Anode, 3 Cathode Red, 4 Cathode Green; Part Description: Right Angle Tricolor (Blue, Red, Green) Surface Mount ChipLED; Manufacturer: AVAGO TECHNOLOGIES; Color: Blue/Red/Green; Table: LEDs & Displays; Bonding: No; PressFit: No; Part Number: LED_AVAGO_HSMF-C113; Component Kind: Standard; Component Type: Standard; PackageDescription: Right Angle Tricolor Surface Mount ChipLED, Body 2.5x1mm; Manufacturer Part Number: HSMF-C113; Pin Count: 4; Mounted: Yes; Socket: No; SMD: Yes; ComponentHeight: 1mm; HelpURL: \\cern.ch\dfs\Applications\Altium\Datasheets\LED_AVAGO_HSMF-C113.pdf; Author: CERN DEM JLC; CreateDate: 29/09/2010; LatestRevisionDate: 29/09/2010; Sense: No
Q1 Q2 = PMGD280UN: Dual N-Channel micro TrenchMOS™ Ultra Low Level FET; Manufacturer: NXP SEMICONDUCTORS; Part Description: 20V 870mA Dual N-Channel micro TrenchMOS™ Ultra Low Level FET; Bonding: No; PressFit: No; Part Number: PMGD280UN; Author: CERN DEM JLC; Case: SOT363; ComponentHeight: 1.1mm; Component Type: Standard; CreateDate: 19/11/2014; Device: PMGD280UN; HelpURL: \\cern.ch\dfs\Applications\Altium\Datasheets\PMGD280UN.pdf; LatestRevisionDate: 19/11/2014; Manufacturer Part Number: PMGD280UN; Mounted: Yes; PackageDescription: SOT363, SC70-6, SOT, 0.65mm Pitch, 6 pin, 1.25mm W X 2.00mm L X 1.10mm H, IPC Medium Density; Pin Count: 6; Sense: No; SMD: Yes; Socket: No
R2 R11 R27 R32-R35 R46 R47 = R0402_200R_1%_0.0625W_100PPM: Resistor - 1%; Part Description: General Purpose Thick Film Chip Resistor; Manufacturer: GENERIC; Manufacturer1 Part Number: 232270672001L; TC: ±100ppm/°C; Table: Resistors SMD; Part Number: R0402_200R_1%_0.0625W_100PPM; Component Kind: Standard; Component Type: Standard; Pin Count: 2; Value: 200; Status: Not recommended; Power: 0.0625W; Tolerance: ±1%; Manufacturer Part Number: R0402_200R_1%_0.0625W_100PPM; Case: 0402; Mounted: Yes; Socket: No; SMD: Yes; Manufacturer1 Example: YAGEO PHYCOMP; Manufacturer1 ComponentHeight: 0.4mm; HelpURL: \\cern.ch\dfs\Applications\Altium\Datasheets\R0402_Phycomp_RC0402.pdf; Author: CERN DEM JLC; CreateDate: 03/12/2007; LatestRevisionDate: 17/10/2012; Sense: No

## Sheet FMC_connector.SchDoc
size A3
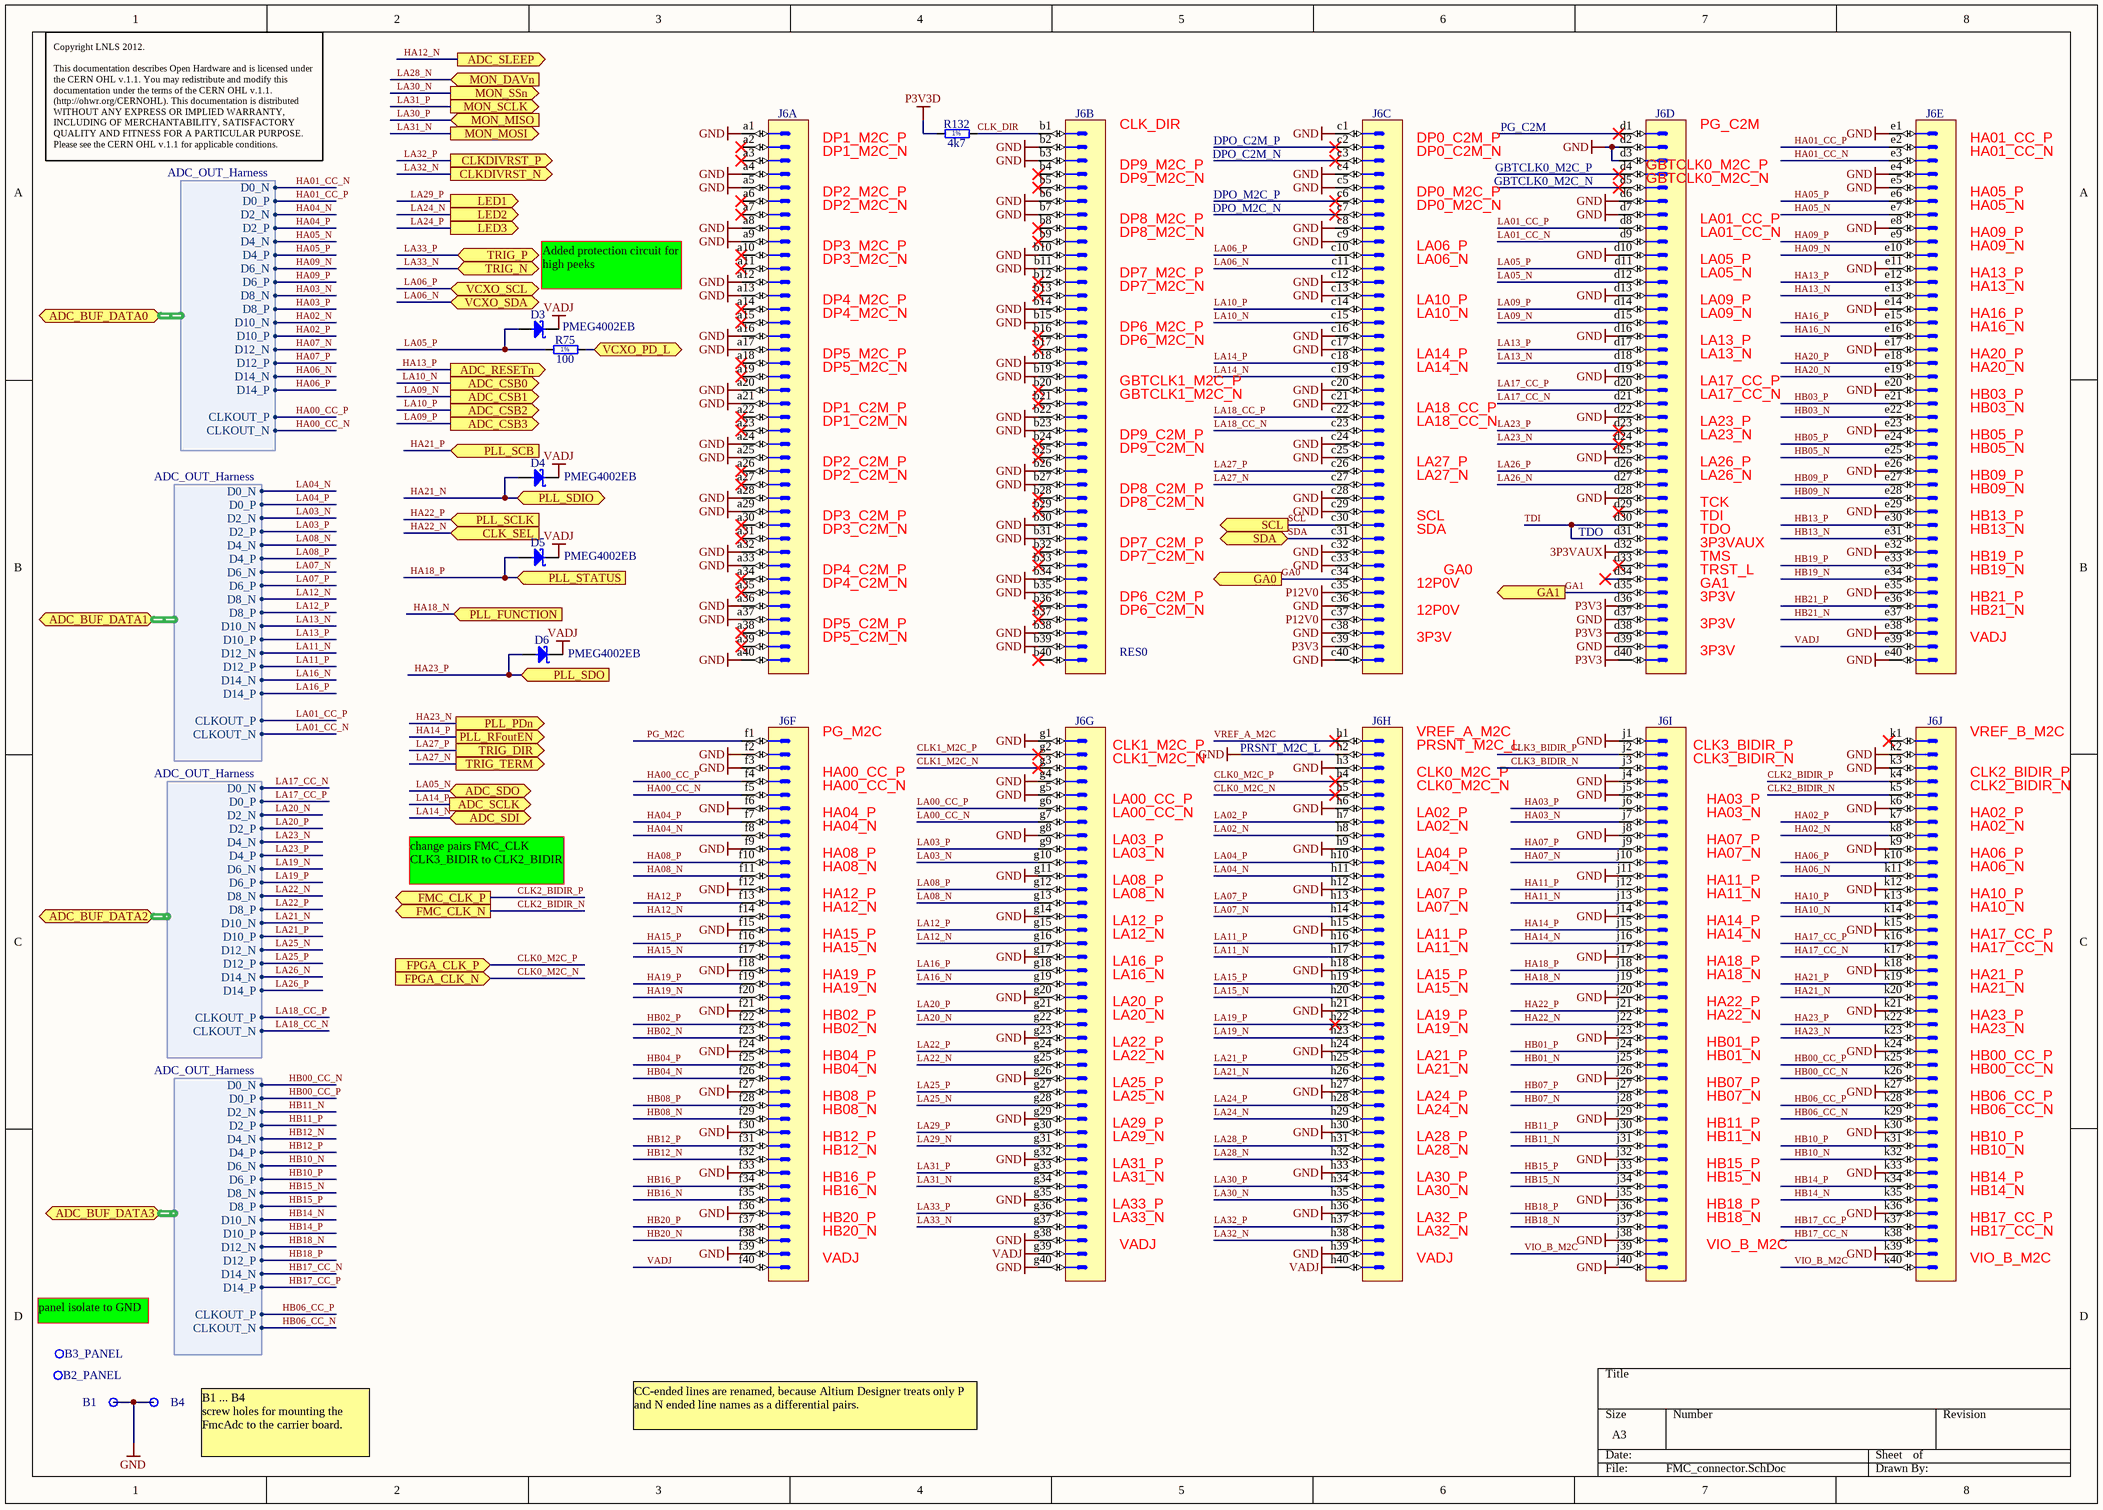
[diagram p2: FMC_connector.SchDoc]

### Parts
B1  Plated Hole  [MTG270_500_M]  (value not drawn)
B2_PANEL  Plated Hole  [MTG270_500_M]  (value not drawn)
B3_PANEL  Plated Hole  [MTG270_500_M]  (value not drawn)
B4  Plated Hole  [MTG270_500_M]  (value not drawn)
D3  PMEG4002EB  [SODFL1608X65N]
D4  PMEG4002EB  [SODFL1608X65N]
D5  PMEG4002EB  [SODFL1608X65N]
D6  PMEG4002EB  [SODFL1608X65N]
J6  (no value)  [SAMTEC_ASP-134488-01]  (parts A,B,C,D,E,F,G,H,I,J of 10)
R75  100  [RESC1005X40N]
R132  4k7  [RESC1005X40N]

### Ports
ADC_BUF_DATA0 (harness ADC_OUT_Harness), ADC_BUF_DATA1 (harness ADC_OUT_Harness), ADC_BUF_DATA2 (harness ADC_OUT_Harness), ADC_BUF_DATA3 (harness ADC_OUT_Harness), ADC_CSB0 (out), ADC_CSB1 (out), ADC_CSB2 (out), ADC_CSB3 (out), ADC_RESETn (out), ADC_SCLK (out), ADC_SDI (bidir), ADC_SDO (bidir), ADC_SLEEP (out), CLK_SEL (in), CLKDIVRST_N (out), CLKDIVRST_P (out), FMC_CLK_N (out), FMC_CLK_P (out), FPGA_CLK_N (in), FPGA_CLK_P (in), GA0 (out), GA1 (out), LED1 (out), LED2 (out), LED3 (out), MON_DAVn (in), MON_MISO (in), MON_MOSI (out), MON_SCLK (out), MON_SSn (out), PLL_FUNCTION (in), PLL_PDn (out), PLL_RFoutEN (out), PLL_SCB (in), PLL_SCLK (in), PLL_SDIO (bidir), PLL_SDO (in), PLL_STATUS (in), SCL (out), SDA (bidir), TRIG_DIR (out), TRIG_N (bidir), TRIG_P (bidir), TRIG_TERM (out), VCXO_PD_L (bidir), VCXO_SCL (bidir), VCXO_SDA (bidir)

### Harnesses
ADC_OUT_Harness: D14_P, D14_N, D12_P, D12_N, D10_P, D10_N, D8_P, D8_N, D6_P, D6_N, D4_P, D4_N, D2_P, D2_N, D0_P, D0_N, CLKOUT_N, CLKOUT_P

### Nets
3P3VAUX: J6.d32
GND: B1.1 B4.1 J6.a1 J6.a4 J6.a5 J6.a8 J6.a9 J6.a12 J6.a13 J6.a16 J6.a17 J6.a20 J6.a21 J6.a24 J6.a25 J6.a28 J6.a29 J6.a32 J6.a33 J6.a36 J6.a37 J6.a40 J6.b2 J6.b3 J6.b6 J6.b7 J6.b10 J6.b11 J6.b14 J6.b15 J6.b18 J6.b19 J6.b22 J6.b23 J6.b26 J6.b27 J6.b30 J6.b31 J6.b34 J6.b35 J6.b38 J6.b39 J6.c1 J6.c4 J6.c5 J6.c8 J6.c9 J6.c12 J6.c13 J6.c16 J6.c17 J6.c20 J6.c21 J6.c24 J6.c25 J6.c28 J6.c29 J6.c32 J6.c33 J6.c36 J6.c38 J6.c40 J6.d2 J6.d3 J6.d6 J6.d7 J6.d10 J6.d13 J6.d16 J6.d19 J6.d22 J6.d25 J6.d28 J6.d37 J6.d39 J6.e1 J6.e4 J6.e5 J6.e8 J6.e11 J6.e14 J6.e17 J6.e20 J6.e23 J6.e26 J6.e29 J6.e32 J6.e35 J6.e38 J6.e40 J6.f2 J6.f3 J6.f6 J6.f9 J6.f12 J6.f15 J6.f18 J6.f21 J6.f24 J6.f27 J6.f30 J6.f33 J6.f36 J6.f39 J6.g1 J6.g4 J6.g5 J6.g8 J6.g11 J6.g14 J6.g17 J6.g20 J6.g23 J6.g26 J6.g29 J6.g32 J6.g35 J6.g38 J6.g40 J6.h2 J6.h3 J6.h6 J6.h9 J6.h12 J6.h15 J6.h18 J6.h21 J6.h24 J6.h27 J6.h30 J6.h33 J6.h36 J6.h39 J6.j1 J6.j4 J6.j5 J6.j8 J6.j11 J6.j14 J6.j17 J6.j20 J6.j23 J6.j26 J6.j29 J6.j32 J6.j35 J6.j38 J6.j40 J6.k2 J6.k3 J6.k6 J6.k9 J6.k12 J6.k15 J6.k18 J6.k21 J6.k24 J6.k27 J6.k30 J6.k33 J6.k36 J6.k39
P3V3: J6.c39 J6.d36 J6.d38 J6.d40
P3V3D: R132.1
P12V0: J6.c35 J6.c37
VADJ: D3.1(C) D4.1(C) D5.1(C) D6.1(C) J6.e39 J6.f40 J6.g39 J6.h40
CLK0_M2C_N: J6.h5 ; port FPGA_CLK_N  [project net FPGA_CLK_N]
CLK0_M2C_P: J6.h4 ; port FPGA_CLK_P  [project net FPGA_CLK_P]
CLK1_M2C_N: J6.g3
CLK1_M2C_P: J6.g2
CLK2_BIDIR_N: J6.k5 ; port FMC_CLK_N  [project net FMC_CLK_N]
CLK2_BIDIR_P: J6.k4 ; port FMC_CLK_P  [project net FMC_CLK_P]
CLK3_BIDIR_N: J6.j3
CLK3_BIDIR_P: J6.j2
CLK_DIR: J6.b1 R132.2
GA0: J6.c34 ; port GA0
GA1: J6.d35 ; port GA1
HA00_CC_N: J6.f5 ; port ADC_BUF_DATA0.CLKOUT_N  [project net ADC_BUF_DATA0.CLKOUT_N]
HA00_CC_P: J6.f4 ; port ADC_BUF_DATA0.CLKOUT_P  [project net ADC_BUF_DATA0.CLKOUT_P]
HA01_CC_N: J6.e3 ; port ADC_BUF_DATA0.D0_N  [project net ADC_BUF_DATA0.D0_N]
HA01_CC_P: J6.e2 ; port ADC_BUF_DATA0.D0_P  [project net ADC_BUF_DATA0.D0_P]
HA02_N: J6.k8 ; port ADC_BUF_DATA0.D10_N  [project net ADC_BUF_DATA0.D10_N]
HA02_P: J6.k7 ; port ADC_BUF_DATA0.D10_P  [project net ADC_BUF_DATA0.D10_P]
HA03_N: J6.j7 ; port ADC_BUF_DATA0.D8_N  [project net ADC_BUF_DATA0.D8_N]
HA03_P: J6.j6 ; port ADC_BUF_DATA0.D8_P  [project net ADC_BUF_DATA0.D8_P]
HA04_N: J6.f8 ; port ADC_BUF_DATA0.D2_N  [project net ADC_BUF_DATA0.D2_N]
HA04_P: J6.f7 ; port ADC_BUF_DATA0.D2_P  [project net ADC_BUF_DATA0.D2_P]
HA05_N: J6.e7 ; port ADC_BUF_DATA0.D4_N  [project net ADC_BUF_DATA0.D4_N]
HA05_P: J6.e6 ; port ADC_BUF_DATA0.D4_P  [project net ADC_BUF_DATA0.D4_P]
HA06_N: J6.k11 ; port ADC_BUF_DATA0.D14_N  [project net ADC_BUF_DATA0.D14_N]
HA06_P: J6.k10 ; port ADC_BUF_DATA0.D14_P  [project net ADC_BUF_DATA0.D14_P]
HA07_N: J6.j10 ; port ADC_BUF_DATA0.D12_N  [project net ADC_BUF_DATA0.D12_N]
HA07_P: J6.j9 ; port ADC_BUF_DATA0.D12_P  [project net ADC_BUF_DATA0.D12_P]
HA08_N: J6.f11
HA08_P: J6.f10
HA09_N: J6.e10 ; port ADC_BUF_DATA0.D6_N  [project net ADC_BUF_DATA0.D6_N]
HA09_P: J6.e9 ; port ADC_BUF_DATA0.D6_P  [project net ADC_BUF_DATA0.D6_P]
HA10_N: J6.k14
HA10_P: J6.k13
HA11_N: J6.j13
HA11_P: J6.j12
HA12_N: J6.f14 ; port ADC_SLEEP  [project net ADC_SLEEP]
HA12_P: J6.f13
HA13_N: J6.e13
HA13_P: J6.e12 ; port ADC_RESETn  [project net ADC_RESETn]
HA14_N: J6.j16
HA14_P: J6.j15 ; port PLL_RFoutEN  [project net PLL_RFoutEN]
HA15_N: J6.f17
HA15_P: J6.f16
HA16_N: J6.e16
HA16_P: J6.e15
HA17_CC_N: J6.k17
HA17_CC_P: J6.k16
HA18_N: J6.j19 ; port PLL_FUNCTION  [project net PLL_FUNCTION]
HA18_P: D5.2(A) J6.j18 ; port PLL_STATUS  [project net PLL_STATUS]
HA19_N: J6.f20
HA19_P: J6.f19
HA20_N: J6.e19
HA20_P: J6.e18
HA21_N: D4.2(A) J6.k20 ; port PLL_SDIO  [project net PLL_SDIO]
HA21_P: J6.k19 ; port PLL_SCB  [project net PLL_SCB]
HA22_N: J6.j22 ; port CLK_SEL  [project net CLK_SEL]
HA22_P: J6.j21 ; port PLL_SCLK  [project net PLL_SCLK]
HA23_N: J6.k23 ; port PLL_PDn  [project net PLL_PDn]
HA23_P: D6.2(A) J6.k22 ; port PLL_SDO  [project net PLL_SDO]
HB00_CC_N: J6.k26 ; port ADC_BUF_DATA3.D0_N  [project net ADC_BUF_DATA3.D0_N]
HB00_CC_P: J6.k25 ; port ADC_BUF_DATA3.D0_P  [project net ADC_BUF_DATA3.D0_P]
HB01_N: J6.j25
HB01_P: J6.j24
HB02_N: J6.f23
HB02_P: J6.f22
HB03_N: J6.e22
HB03_P: J6.e21
HB04_N: J6.f26
HB04_P: J6.f25
HB05_N: J6.e25
HB05_P: J6.e24
HB06_CC_N: J6.k29 ; port ADC_BUF_DATA3.CLKOUT_N  [project net ADC_BUF_DATA3.CLKOUT_N]
HB06_CC_P: J6.k28 ; port ADC_BUF_DATA3.CLKOUT_P  [project net ADC_BUF_DATA3.CLKOUT_P]
HB07_N: J6.j28
HB07_P: J6.j27
HB08_N: J6.f29
HB08_P: J6.f28
HB09_N: J6.e28
HB09_P: J6.e27
HB10_N: J6.k32 ; port ADC_BUF_DATA3.D6_N  [project net ADC_BUF_DATA3.D6_N]
HB10_P: J6.k31 ; port ADC_BUF_DATA3.D6_P  [project net ADC_BUF_DATA3.D6_P]
HB11_N: J6.j31 ; port ADC_BUF_DATA3.D2_N  [project net ADC_BUF_DATA3.D2_N]
HB11_P: J6.j30 ; port ADC_BUF_DATA3.D2_P  [project net ADC_BUF_DATA3.D2_P]
HB12_N: J6.f32 ; port ADC_BUF_DATA3.D4_N  [project net ADC_BUF_DATA3.D4_N]
HB12_P: J6.f31 ; port ADC_BUF_DATA3.D4_P  [project net ADC_BUF_DATA3.D4_P]
HB13_N: J6.e31
HB13_P: J6.e30
HB14_N: J6.k35 ; port ADC_BUF_DATA3.D10_N  [project net ADC_BUF_DATA3.D10_N]
HB14_P: J6.k34 ; port ADC_BUF_DATA3.D10_P  [project net ADC_BUF_DATA3.D10_P]
HB15_N: J6.j34 ; port ADC_BUF_DATA3.D8_N  [project net ADC_BUF_DATA3.D8_N]
HB15_P: J6.j33 ; port ADC_BUF_DATA3.D8_P  [project net ADC_BUF_DATA3.D8_P]
HB16_N: J6.f35
HB16_P: J6.f34
HB17_CC_N: J6.k38 ; port ADC_BUF_DATA3.D14_N  [project net ADC_BUF_DATA3.D14_N]
HB17_CC_P: J6.k37 ; port ADC_BUF_DATA3.D14_P  [project net ADC_BUF_DATA3.D14_P]
HB18_N: J6.j37 ; port ADC_BUF_DATA3.D12_N  [project net ADC_BUF_DATA3.D12_N]
HB18_P: J6.j36 ; port ADC_BUF_DATA3.D12_P  [project net ADC_BUF_DATA3.D12_P]
HB19_N: J6.e34
HB19_P: J6.e33
HB20_N: J6.f38
HB20_P: J6.f37
HB21_N: J6.e37
HB21_P: J6.e36
LA00_CC_N: J6.g7
LA00_CC_P: J6.g6
LA01_CC_N: J6.d9 ; port ADC_BUF_DATA1.CLKOUT_N  [project net ADC_BUF_DATA1.CLKOUT_N]
LA01_CC_P: J6.d8 ; port ADC_BUF_DATA1.CLKOUT_P  [project net ADC_BUF_DATA1.CLKOUT_P]
LA02_N: J6.h8
LA02_P: J6.h7
LA03_N: J6.g10 ; port ADC_BUF_DATA1.D2_N  [project net ADC_BUF_DATA1.D2_N]
LA03_P: J6.g9 ; port ADC_BUF_DATA1.D2_P  [project net ADC_BUF_DATA1.D2_P]
LA04_N: J6.h11 ; port ADC_BUF_DATA1.D0_N  [project net ADC_BUF_DATA1.D0_N]
LA04_P: J6.h10 ; port ADC_BUF_DATA1.D0_P  [project net ADC_BUF_DATA1.D0_P]
LA05_N: J6.d12 ; port ADC_SDO  [project net ADC_SDO]
LA05_P: D3.2(A) J6.d11 R75.1
LA06_N: J6.c11 ; port VCXO_SDA  [project net Si_SDA]
LA06_P: J6.c10 ; port VCXO_SCL  [project net Si_SCL]
LA07_N: J6.h14 ; port ADC_BUF_DATA1.D6_N  [project net ADC_BUF_DATA1.D6_N]
LA07_P: J6.h13 ; port ADC_BUF_DATA1.D6_P  [project net ADC_BUF_DATA1.D6_P]
LA08_N: J6.g13 ; port ADC_BUF_DATA1.D4_N  [project net ADC_BUF_DATA1.D4_N]
LA08_P: J6.g12 ; port ADC_BUF_DATA1.D4_P  [project net ADC_BUF_DATA1.D4_P]
LA09_N: J6.d15 ; port ADC_CSB1  [project net ADC_CSB1]
LA09_P: J6.d14 ; port ADC_CSB3  [project net ADC_CSB3]
LA10_N: J6.c15 ; port ADC_CSB0  [project net ADC_CSB0]
LA10_P: J6.c14 ; port ADC_CSB2  [project net ADC_CSB2]
LA11_N: J6.h17 ; port ADC_BUF_DATA1.D12_N  [project net ADC_BUF_DATA1.D12_N]
LA11_P: J6.h16 ; port ADC_BUF_DATA1.D12_P  [project net ADC_BUF_DATA1.D12_P]
LA12_N: J6.g16 ; port ADC_BUF_DATA1.D8_N  [project net ADC_BUF_DATA1.D8_N]
LA12_P: J6.g15 ; port ADC_BUF_DATA1.D8_P  [project net ADC_BUF_DATA1.D8_P]
LA13_N: J6.d18 ; port ADC_BUF_DATA1.D10_N  [project net ADC_BUF_DATA1.D10_N]
LA13_P: J6.d17 ; port ADC_BUF_DATA1.D10_P  [project net ADC_BUF_DATA1.D10_P]
LA14_N: J6.c19 ; port ADC_SDI  [project net ADC_SDI]
LA14_P: J6.c18 ; port ADC_SCLK  [project net ADC_SCLK]
LA15_N: J6.h20
LA15_P: J6.h19
LA16_N: J6.g19 ; port ADC_BUF_DATA1.D14_N  [project net ADC_BUF_DATA1.D14_N]
LA16_P: J6.g18 ; port ADC_BUF_DATA1.D14_P  [project net ADC_BUF_DATA1.D14_P]
LA17_CC_N: J6.d21 ; port ADC_BUF_DATA2.D0_N  [project net ADC_BUF_DATA2.D0_N]
LA17_CC_P: J6.d20 ; port ADC_BUF_DATA2.D0_P  [project net ADC_BUF_DATA2.D0_P]
LA18_CC_N: J6.c23 ; port ADC_BUF_DATA2.CLKOUT_N  [project net ADC_BUF_DATA2.CLKOUT_N]
LA18_CC_P: J6.c22 ; port ADC_BUF_DATA2.CLKOUT_P  [project net ADC_BUF_DATA2.CLKOUT_P]
LA19_N: J6.h23 ; port ADC_BUF_DATA2.D6_N  [project net ADC_BUF_DATA2.D6_N]
LA19_P: J6.h22 ; port ADC_BUF_DATA2.D6_P  [project net ADC_BUF_DATA2.D6_P]
LA20_N: J6.g22 ; port ADC_BUF_DATA2.D2_N  [project net ADC_BUF_DATA2.D2_N]
LA20_P: J6.g21 ; port ADC_BUF_DATA2.D2_P  [project net ADC_BUF_DATA2.D2_P]
LA21_N: J6.h26 ; port ADC_BUF_DATA2.D10_N  [project net ADC_BUF_DATA2.D10_N]
LA21_P: J6.h25 ; port ADC_BUF_DATA2.D10_P  [project net ADC_BUF_DATA2.D10_P]
LA22_N: J6.g25 ; port ADC_BUF_DATA2.D8_N  [project net ADC_BUF_DATA2.D8_N]
LA22_P: J6.g24 ; port ADC_BUF_DATA2.D8_P  [project net ADC_BUF_DATA2.D8_P]
LA23_N: J6.d24 ; port ADC_BUF_DATA2.D4_N  [project net ADC_BUF_DATA2.D4_N]
LA23_P: J6.d23 ; port ADC_BUF_DATA2.D4_P  [project net ADC_BUF_DATA2.D4_P]
LA24_N: J6.h29 ; port LED2
LA24_P: J6.h28 ; port LED3
LA25_N: J6.g28 ; port ADC_BUF_DATA2.D12_N  [project net ADC_BUF_DATA2.D12_N]
LA25_P: J6.g27 ; port ADC_BUF_DATA2.D12_P  [project net ADC_BUF_DATA2.D12_P]
LA26_N: J6.d27 ; port ADC_BUF_DATA2.D14_N  [project net ADC_BUF_DATA2.D14_N]
LA26_P: J6.d26 ; port ADC_BUF_DATA2.D14_P  [project net ADC_BUF_DATA2.D14_P]
LA27_N: J6.c27 ; port TRIG_TERM  [project net TRIG_TERM]
LA27_P: J6.c26 ; port TRIG_DIR  [project net TRIG_DIR]
LA28_N: J6.h32 ; port MON_DAVn
LA28_P: J6.h31
LA29_N: J6.g31
LA29_P: J6.g30 ; port LED1
LA30_N: J6.h35 ; port MON_SSn
LA30_P: J6.h34 ; port MON_MISO
LA31_N: J6.g34 ; port MON_MOSI
LA31_P: J6.g33 ; port MON_SCLK
LA32_N: J6.h38 ; port CLKDIVRST_N  [project net CLKDIVRST_N]
LA32_P: J6.h37 ; port CLKDIVRST_P  [project net CLKDIVRST_P]
LA33_N: J6.g37 ; port TRIG_N
LA33_P: J6.g36 ; port TRIG_P
PG_M2C: J6.f1
SCL: J6.c30 ; port SCL
SDA: J6.c31 ; port SDA
Si_OE: R75.2 ; port VCXO_PD_L
TDI: J6.d30 J6.d31
VIO_B_M2C: J6.j39 J6.k40
VREF_A_M2C: J6.h1

Not connected (* = marked no-connect by the designer): B2_PANEL 1; B3_PANEL 1; J6 a2* a3* a6* a7* a10* a11* a14* a15* a18* a19* a22* a23* a26* a27* a30* a31* a34* a35* a38* a39* b4* b5* b8* b9* b12* b13* b16* b17* b20* b21* b24* b25* b28* b29* b32* b33* b36* b37* b40* c2* c3* c6* c7* d1* d4* d5* d29* d33* d34* k1*

### Notes on the sheet
- Copyright LNLS 2012.
  This documentation describes Open Hardware and is licensed under the CERN OHL v.1.1. You may redistribute and modify this documentation under the terms of the CERN OHL v.1.1. (http://ohwr.org/CERNOHL). This documentation is distributed WITHOUT ANY EXPRESS OR IMPLIED WARRANTY, INCLUDING OF MERCHANTABILITY, SATISFACTORY QUALITY AND FITNESS FOR A PARTICULAR PURPOSE. Please see the CERN OHL v.1.1 for applicable conditions.
- DP1_M2C_P
- DP1_M2C_N
- CLK_DIR
- DP9_M2C_P
- DP9_M2C_N
- DPO_C2M_P
- DPO_C2M_N
- DP0_C2M_P
- DP0_C2M_N
- PG_C2M
- GBTCLK0_M2C_P
- GBTCLK0_M2C_N
- (near J6) GBTCLK0_M2C_P
- (near J6) GBTCLK0_M2C_N
- HA01_CC_P
- HA01_CC_N
- DP2_M2C_P
- DP2_M2C_N
- DP8_M2C_P
- DP8_M2C_N
- DPO_M2C_P
- DPO_M2C_N
- DP0_M2C_P
- DP0_M2C_N
- LA01_CC_P
- LA01_CC_N
- HA05_P
- HA05_N
- HA09_P
- Added protection circuit for high peeks
- DP3_M2C_P
- DP3_M2C_N
- DP4_M2C_P
- DP4_M2C_N
- DP7_M2C_P
- DP7_M2C_N
- LA06_P
- LA06_N
- LA10_P
- LA10_N
- LA05_P
- LA05_N
- LA09_P
- LA09_N
- HA09_N
- HA13_P
- HA13_N
- HA16_P
- DP5_M2C_P
- DP5_M2C_N
- DP6_M2C_P
- DP6_M2C_N
- LA14_P
- LA14_N
- LA13_P
- LA13_N
- HA16_N
- HA20_P
- HA20_N
- DP1_C2M_P
- DP1_C2M_N
- GBTCLK1_M2C_P
- GBTCLK1_M2C_N
- DP9_C2M_P
- DP9_C2M_N
- LA18_CC_P
- LA18_CC_N
- LA17_CC_P
- LA17_CC_N
- LA23_P
- LA23_N
- HB03_P
- HB03_N
- HB05_P
- HB05_N
- DP2_C2M_P
- DP2_C2M_N
- DP8_C2M_P
- DP8_C2M_N
- LA27_P
- LA27_N
- LA26_P
- LA26_N
- TCK
- HB09_P
- HB09_N
- DP3_C2M_P
- DP3_C2M_N
- DP4_C2M_P
- DP4_C2M_N
- DP7_C2M_P
- DP7_C2M_N
- SCL
- SDA
- 12P0V
- GA0
- (near J6) TDO
- TDI
- TDO
- 3P3VAUX
- TMS
- TRST_L
- GA1
- HB13_P
- HB13_N
- HB19_P
- HB19_N
- DP5_C2M_P
- DP5_C2M_N
- DP6_C2M_P
- DP6_C2M_N
- 3P3V
- HB21_P
- HB21_N
- VADJ
- RES0
- PG_M2C
- HA00_CC_P
- (near J6) CLK1_M2C_P
- (near J6) CLK1_M2C_N
- (near J6) PRSNT_M2C_L
- VREF_A_M2C
- PRSNT_M2C_L
- CLK0_M2C_P
- (near J6) CLK3_BIDIR_P
- (near J6) CLK3_BIDIR_N
- VREF_B_M2C
- CLK2_BIDIR_P
- HA00_CC_N
- HA04_P
- HA04_N
- HA08_P
- (near J6) LA00_CC_P
- (near J6) LA00_CC_N
- (near J6) LA03_P
- (near J6) LA03_N
- CLK0_M2C_N
- LA02_P
- LA02_N
- LA04_P
- HA03_P
- HA03_N
- HA07_P
- HA07_N
- CLK2_BIDIR_N
- HA02_P
- HA02_N
- HA06_P
- change pairs FMC_CLK CLK3_BIDIR to CLK2_BIDIR
- HA08_N
- HA12_P
- HA12_N
- (near J6) LA08_P
- (near J6) LA08_N
- LA04_N
- LA07_P
- LA07_N
- HA11_P
- HA11_N
- HA06_N
- HA10_P
- HA10_N
- HA15_P
- HA15_N
- HA19_P
- HA19_N
- (near J6) LA12_P
- (near J6) LA12_N
- (near J6) LA16_P
- (near J6) LA16_N
- LA11_P
- LA11_N
- LA15_P
- LA15_N
- HA14_P
- HA14_N
- HA18_P
- HA18_N
- HA17_CC_P
- HA17_CC_N
- HA21_P
- HA21_N
- HB02_P
- HB02_N
- (near J6) LA20_P
- (near J6) LA20_N
- (near J6) LA22_P
- LA19_P
- LA19_N
- HA22_P
- HA22_N
- HB01_P
- HA23_P
- HA23_N
- HB04_P
- HB04_N
- HB08_P
- HB08_N
- (near J6) LA22_N
- (near J6) LA25_P
- (near J6) LA25_N
- (near J6) LA29_P
- LA21_P
- LA21_N
- LA24_P
- LA24_N
- HB01_N
- HB07_P
- HB07_N
- HB11_P
- HB00_CC_P
- HB00_CC_N
- HB06_CC_P
- HB06_CC_N
- HB12_P
- HB12_N
- HB16_P
- (near J6) LA29_N
- (near J6) LA31_P
- (near J6) LA31_N
- LA28_P
- LA28_N
- LA30_P
- HB11_N
- HB15_P
- HB15_N
- HB10_P
- HB10_N
- HB14_P
- HB16_N
- HB20_P
- HB20_N
- (near J6) LA33_P
- (near J6) LA33_N
- LA30_N
- LA32_P
- LA32_N
- HB18_P
- HB18_N
- VIO_B_M2C
- HB14_N
- HB17_CC_P
- HB17_CC_N
- (near B3_PANEL) panel isolate to GND
- (near B4) B1 ... B4
  screw holes for mounting the FmcAdc to the carrier board.
- CC-ended lines are renamed, because Altium Designer treats only P and N ended line names as a differential pairs.
- (in symbol R0402_4K7_1%_0.0625W_100PPM) 1%
- (in symbol R0402_100R_1%_0.0625W_100PPM) 1%

### Library data of the parts
B1 B2_PANEL B3_PANEL B4 = PLATED_HOLE2.7_PAD5.0_M: Single Terminal Socket; Part Description: Plated Through Hole: Hole Dia.=2.7mm Pad Dia.=5.0mm Middle hole 3mm; Mounted: No; Part Number: PLATED_HOLE2.7_PAD5.0_M; Component Kind: Standard (No BOM); Component Type: Standard (No BOM); Pin Count: 1; Family: Plated Hole; Socket: No; SMD: No; Status: None; ComponentHeight: 0mm; Author: LNLS DIG FCS; CreateDate: 06/06/2016; LatestRevisionDate: 06/06/2016; PackageDescription: Plated Through Hole: Hole Dia.=2.7mm Pad Dia.=5.0mm Middle hole 3mm; Sense: No; HelpURL: Undefined
D3-D6 = PMEG4002EB: Schottky Diode; Part Description: Very Low VF MEGA Schottky Barrier Rectifier; Manufacturer: NXP SEMICONDUCTORS; Voltage: 40V; Power: 200mA; Table: Diodes; Bonding: No; PressFit: No; Part Number: PMEG4002EB; Component Kind: Standard; Component Type: Standard; Device: PMEG4002EB; PackageDescription: Ultra Small Outline Diode Flat Lead (SOD-523), Body; 1.2mm L X 0.8mm W X 0.65mm H, IPC Medium Density; Manufacturer Part Number: PMEG4002EB; Pin Count: 2; Case: SOD523; Mounted: Yes; Socket: No; SMD: Yes; ComponentHeight: 0.65mm; HelpURL: \\cern.ch\dfs\Applications\Altium\Datasheets\PMEG4002EB.pdf; Author: CERN DEM JMW; CreateDate: 21/04/2009; LatestRevisionDate: 07/05/2009; Sense: No
J6 = SAMTEC_ASP-134488-01: Connector VITA 57, 400 Male contacts in 10 row abcdefghj; Part Description: 400 contacts (10 rows abcdefghj) Surface Mount Male Connector, VITA 57 (MC-HPC-10); Manufacturer: SAMTEC; PressFit: No; Part Number: SAMTEC_ASP-134488-01; Component Kind: Standard; Component Type: Standard; Pin Count: 400; Family: VITA 57; Mounted: Yes; Socket: No; SMD: Yes; Status: None; Manufacturer Part Number: ASP-134488-01; ComponentHeight: 6.1mm; HelpURL: \\cern.ch\dfs\Applications\Altium\Datasheets\SAMTEC_ASP-134488-01.pdf; Author: CERN DEM JLC; CreateDate: 30/04/2009; LatestRevisionDate: 17/08/2009; Table: SAMTEC; Sense: No
R75 = R0402_100R_1%_0.0625W_100PPM: Resistor - 1%; Part Description: General Purpose Thick Film Chip Resistor; Manufacturer: GENERIC; Manufacturer1 Part Number: 232270671001L; TC: ±100ppm/°C; Part Number: R0402_100R_1%_0.0625W_100PPM; Component Kind: Standard; Component Type: Standard; Pin Count: 2; Value: 100; Status: Not recommended; Power: 0.0625W; Tolerance: ±1%; Manufacturer Part Number: R0402_100R_1%_0.0625W_100PPM; Case: 0402; Mounted: Yes; Sense: No; Socket: No; SMD: Yes; HelpURL: \\cern.ch\dfs\Applications\Altium\Datasheets\R0402_Phycomp_RC0402.pdf; Author: CERN DEM JLC; CreateDate: 03/12/2007; LatestRevisionDate: 17/10/2012; Manufacturer1 Example: YAGEO PHYCOMP; Manufacturer1 ComponentHeight: 0.4mm
R132 = R0402_4K7_1%_0.0625W_100PPM: Resistor - 1%; Part Description: General Purpose Thick Film Chip Resistor; Manufacturer: GENERIC; Manufacturer1 Part Number: 232270674702L; TC: ±100ppm/°C; Part Number: R0402_4K7_1%_0.0625W_100PPM; Component Kind: Standard; Component Type: Standard; Pin Count: 2; Value: 4k7; Status: Not recommended; Power: 0.0625W; Tolerance: ±1%; Manufacturer Part Number: R0402_4K7_1%_0.0625W_100PPM; Case: 0402; Mounted: Yes; Socket: No; SMD: Yes; Manufacturer1 Example: YAGEO PHYCOMP; Manufacturer1 ComponentHeight: 0.4mm; HelpURL: \\cern.ch\dfs\Applications\Altium\Datasheets\R0402_Phycomp_RC0402.pdf; Author: CERN DEM JLC; CreateDate: 03/12/2007; LatestRevisionDate: 17/10/2012; Sense: No